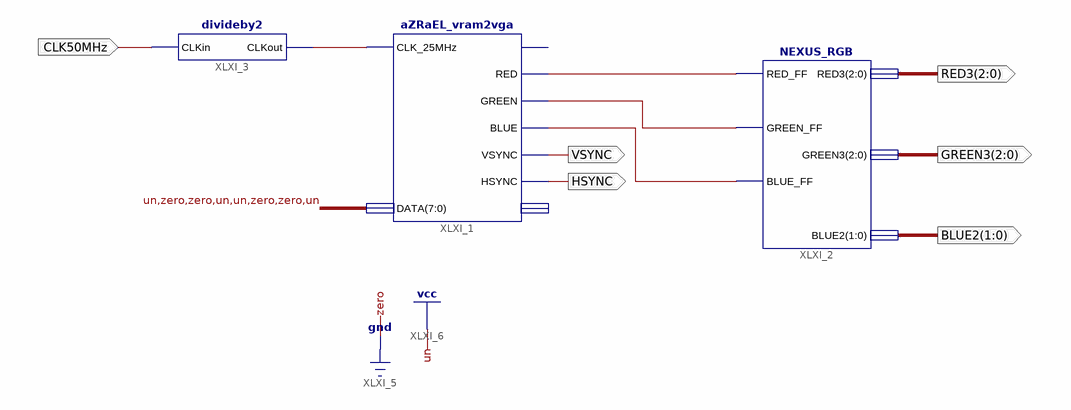
[diagram p0: schematic sheet 1]
// Xilinx ISE schematic VGA_test.sch (spartan3e) as structural Verilog: 3 symbols, 6 ports
module VGA_test (
  input  CLK50MHz,
  output VSYNC,
  output HSYNC,
  output [2:0] RED3,
  output [2:0] GREEN3,
  output [1:0] BLUE2
);

  wire XLXN_2, XLXN_3, XLXN_4, XLXN_5;

  aZRaEL_vram2vga XLXI_1 (
    .CLK_25MHz(XLXN_2), .DATA(8'b10011001), .RED(XLXN_3), .GREEN(XLXN_4), .BLUE(XLXN_5), .VSYNC(VSYNC),
    .HSYNC(HSYNC));  // open: R, ADDRESS
  NEXUS_RGB XLXI_2 (.RED_FF(XLXN_3), .GREEN_FF(XLXN_4), .BLUE_FF(XLXN_5), .RED3(RED3), .GREEN3(GREEN3), .BLUE2(BLUE2));
  divideby2 XLXI_3 (.CLKin(CLK50MHz), .CLKout(XLXN_2));
endmodule
